# EAGLE board LiPoLoader_td (EAGLE 5.09), part 1 of 2
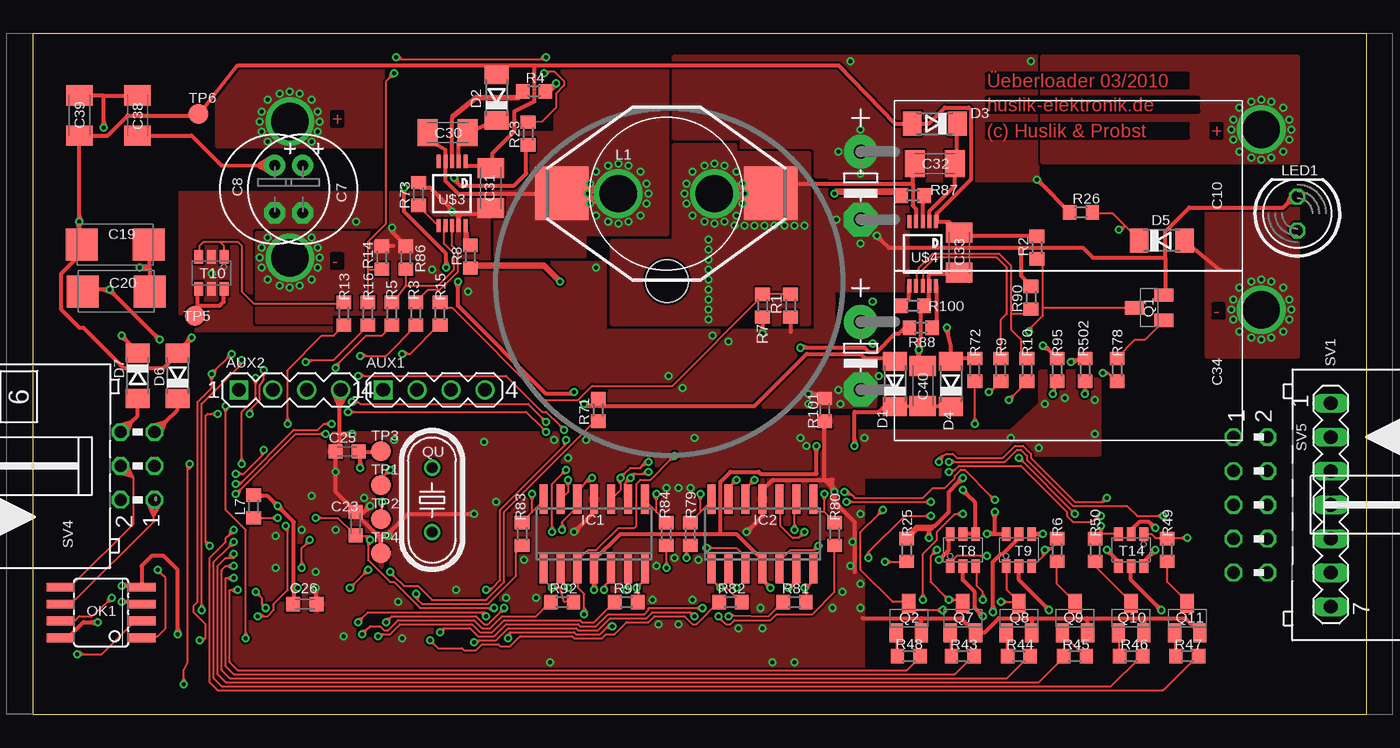
[diagram p2: board, top side]
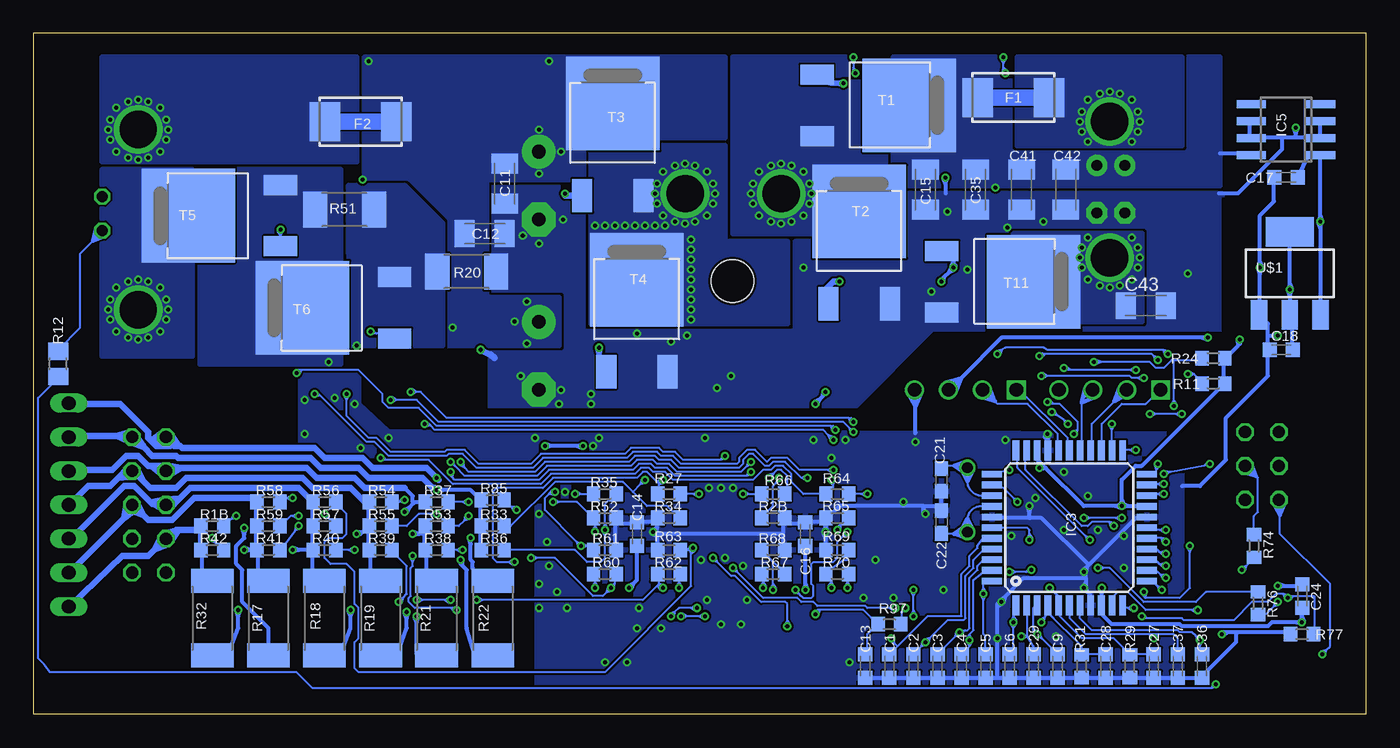
[diagram p3: board, bottom side, seen from below]

Size 99.8 x 51 mm. Coordinates in mm from the lower left corner, seen from the top.
Copper layers (1*16): Top 0.035mm / dielectric 1.5mm / Bottom 0.035mm
Design rules "Fischer-LP *": minimum track width 0.15mm, minimum drill 0.3mm, track to track 0.15mm, track to pad 0.15mm, pad to pad 0.15mm, via to via 0.15mm, smd to smd 0mil, copper to edge 0.2mm, drill to drill 0.3mm, minimum pad ring 0.2mm, minimum via ring 0.15mm, stop-mask expansion 0.1mm, vias tented up to drill 0.5mm, thermal gap 0.15mm
Net classes: 1 Hi-Power: width 0.3 mm; 2 Lo-Power: width 0.3 mm; 3 Iso-bus: clearance 0.6 mm to class 0, clearance 0.6 mm to class 1, clearance 0.6 mm to class 2
Holes 3.2 mm at 47.46,32.46
tRestrict: 16 lines
bRestrict: 9 lines
vRestrict: area 22.6,28.6 to 30.4,29.9

## Footprints (pad centres in the part's own frame; a part is rotated, then mirrored left to right if it is on the bottom)
MA04-1 = drill 1.016 square: 1 -3.81,0 | drill 1.016 round: 2 -1.27,0; 3 1.27,0; 4 3.81,0
SOLPAD3MM = drill 2.8 round: P$1 0,0
C0603K = smd 1.05 x 1.08: 1 -0.875,0; 2 0.875,0
E3,5-8 = drill 0.813 pad 1.6 round: + -1.778,0 | drill 0.813 pad 1.6 octagon: - 1.778,0
E5-13-L = drill 1.016 pad 2.54 round: + -2.54,0 | drill 1.016 pad 2.54 octagon: - 2.54,0
C1206K = smd 1.5 x 2: 1 -1.5,0; 2 1.5,0
SMC_C = smd 2.4 x 2.4: + -2.5,0; - 2.5,0
C0603 = smd 1.1 x 1: 1 -0.85,0; 2 0.85,0
SOD80C = smd 1.4 x 1.8: A 1.7,0; C -1.7,0
WSC2515 = smd 2.29 x 2.92: 1 -2.675,0; 2 2.675,0
SO14 = smd 0.6 x 2.2: 1 -3.81,-2.6; 2 -2.54,-2.6; 3 -1.27,-2.6; 4 0,-2.6; 5 1.27,-2.6; 6 2.54,-2.6; 7 3.81,-2.6; 8 3.81,2.6; 9 2.54,2.6; 10 1.27,2.6; 11 0,2.6; 12 -1.27,2.6; 13 -2.54,2.6; 14 -3.81,2.6
TQFP44 = smd 1.5 x 0.5: 1 -5.8,4; 2 -5.8,3.2; 3 -5.8,2.4; 4 -5.8,1.6; 5 -5.8,0.8; 6 -5.8,0; 7 -5.8,-0.8; 8 -5.8,-1.6; 9 -5.8,-2.4; 10 -5.8,-3.2; 11 -5.8,-4; 23 5.8,-4; 24 5.8,-3.2; 25 5.8,-2.4; 26 5.8,-1.6; 27 5.8,-0.8; 28 5.8,0; 29 5.8,0.8; 30 5.8,1.6; 31 5.8,2.4; 32 5.8,3.2; 33 5.8,4 | smd 0.5 x 1.5: 12 -4,-5.8; 13 -3.2,-5.8; 14 -2.4,-5.8; 15 -1.6,-5.8; 16 -0.8,-5.8; 17 0,-5.8; 18 0.8,-5.8; 19 1.6,-5.8; 20 2.4,-5.8; 21 3.2,-5.8; 22 4,-5.8; 34 4,5.8; 35 3.2,5.8; 36 2.4,5.8; 37 1.6,5.8; 38 0.8,5.8; 39 0,5.8; 40 -0.8,5.8; 41 -1.6,5.8; 42 -2.4,5.8; 43 -3.2,5.8; 44 -4,5.8
SO08 = smd 0.6 x 2.2: 1 -1.905,-2.6; 2 -0.635,-2.6; 3 0.635,-2.6; 4 1.905,-2.6; 5 1.905,2.6; 6 0.635,2.6; 7 -0.635,2.6; 8 -1.905,2.6
D333 = smd 4 x 4: 1 -7.82,0; 2 7.82,0
R0603 = smd 1 x 1.1: 1 -0.85,0; 2 0.85,0
LED5MM = drill 0.813 octagon: A -1.27,0; K 1.27,0
SOIC08 = smd 0.66 x 2.032: 1 -1.905,-3.073; 2 -0.635,-3.073; 3 0.635,-3.073; 4 1.905,-3.073; 5 1.905,3.073; 6 0.635,3.073; 7 -0.635,3.073; 8 -1.905,3.073
SOT23-BEC = smd 1 x 1.4: B -0.95,-1.1; C 0,1.1; E 0.95,-1.1
HC49U-V = drill 0.813 round: 1 -2.413,0; 2 2.413,0
R0805 = smd 1.3 x 1.5: 1 -0.95,0; 2 0.95,0
R2512 = smd 1.8 x 3.2: 1 -2.8,0; 2 2.8,0
R2010 = smd 1.8 x 2.7: 1 -2.2,0; 2 2.2,0
MA07-1 = drill 1.016 long: 1 -7.62,0; 2 -5.08,0; 3 -2.54,0; 4 0,0; 5 2.54,0; 6 5.08,0; 7 7.62,0
ML6L = drill 0.914 octagon: 1 -2.54,-1.27; 2 -2.54,1.27; 3 0,-1.27; 4 0,1.27; 5 2.54,-1.27; 6 2.54,1.27
ML10L = drill 0.914 octagon: 1 -5.08,-1.27; 2 -5.08,1.27; 3 -2.54,-1.27; 4 -2.54,1.27; 5 0,-1.27; 6 0,1.27; 7 2.54,-1.27; 8 2.54,1.27; 9 5.08,-1.27; 10 5.08,1.27
DPAK = smd 1.5 x 2.5: 1 -2.3,-6.9; 3 2.3,-6.9 | smd 7 x 7: 4 0,0
SUPERSOT-6 = smd 0.65 x 1: P$1 -0.95,-1.2; P$2 0,-1.2; P$3 0.95,-1.2; P$4 0.95,1.2; P$5 0,1.2; P$6 -0.95,1.2
TP15R = smd 1.5 x 1.5: TP 0,0
SOT223 = smd 1.219 x 2.235: LEFT -2.311,-3.099; MID 0,-3.099; RIGHT 2.311,-3.099 | smd 3.6 x 2.2: TAP 0,3.099
MSOP10W = smd 0.3 x 1: 1 -1,-2.4; 2 -0.5,-2.4; 3 0,-2.4; 4 0.5,-2.4; 5 1,-2.4; 6 1,2.4; 7 0.5,2.4; 8 0,2.4; 9 -0.5,2.4; 10 -1,2.4

## Placement (x,y rotation side)
AUX1  aux  [MA04-1]  30,24.3 0 top
AUX2  encoder  [MA04-1]  19.2,24.3 0 top
BATT+  SOLPAD3MM  [SOLPAD3MM]  91.95,43.8 0 top
BATT-  SOLPAD3MM  [SOLPAD3MM]  91.95,30.3 0 top
C1  100n  [C0603K]  35.7,3.6 90 bottom
C2  100n  [C0603K]  33.9,3.6 90 bottom
C3  100n  [C0603K]  32.1,3.6 90 bottom
C4  100n  [C0603K]  30.3,3.6 90 bottom
C5  100n  [C0603K]  28.5,3.6 90 bottom
C6  100n  [C0603K]  26.7,3.6 90 bottom
C7  330µF / 25V  [E3,5-8]  20.16,39.34 270 top
C8  330µF / 25V  [E3,5-8]  18.07,39.34 270 top
C9  100n  [C0603K]  23.1,3.6 90 bottom
C10  1000µF/35V  [E5-13-L]  61.95,39.6 270 top
C11  1u  [C1206K]  64.5,39.75 90 bottom
C12  10µF  [C1206K]  66,36 0 bottom
C13  100n  [C0603K]  37.5,3.6 90 bottom
C14  100n  [C0603K]  54.6,13.5 270 bottom
C15  1u  [C1206K]  33,39.3 90 bottom
C16  100n  [C0603K]  42,13.5 270 bottom
C17  100n  [C0603K]  6,40.2 0 bottom
C18  100n  [C0603K]  6.35,27.3 0 bottom
C19  100u Tan  [SMC_C]  6.13,35.18 0 top
C20  100u Tan  [SMC_C]  6.2,31.67 0 top
C21  10p  [C0603]  31.8,17.55 90 bottom
C22  10p  [C0603]  31.8,14.4 270 bottom
C23  100n  [C0603K]  24.13,14.29 270 top
C24  100n  [C0603K]  4.78,8.86 270 bottom
C25  100n  [C0603K]  23.5,19.68 0 top
C26  100n  [C0603K]  20.32,8.26 180 top
C27  100n  [C0603K]  15.9,3.6 90 bottom
C28  100n  [C0603K]  19.5,3.6 90 bottom
C29  100n  [C0603K]  24.9,3.6 90 bottom
C30  1u  [C1206K]  31.01,43.56 0 top
C31  1u  [C1206K]  34.26,39.41 90 top
C32  1u  [C1206K]  67.5,41.25 0 top
C33  1u  [C1206K]  69.33,34.58 90 top
C34  1000µF/35V  [E5-13-L]  61.95,26.85 270 top
C35  10µF  [C1206K]  29.25,39.3 270 bottom
C36  100n  [C0603K]  12.3,3.6 90 bottom
C37  100n  [C0603K]  14.1,3.6 90 bottom
C38  1u  [C1206K]  7.8,44.85 270 top
C39  1u  [C1206K]  3.45,44.85 270 top
C40  1u  [C1206K]  66.6,24.6 270 top
C41  10µF  [C1206K]  25.8,39.3 270 bottom
C42  10µF  [C1206K]  22.5,39.3 270 bottom
C43  10µF  [C1206K]  16.5,30.6 0 bottom
COIL1  SOLPAD3MM  [SOLPAD3MM]  43.8,39 0 top
COIL2  SOLPAD3MM  [SOLPAD3MM]  51,39 0 top
D1  LL43-GS08  [SOD80C]  64.5,24.75 90 top
D2  LL43-GS08  [SOD80C]  34.67,46.18 90 top
D3  LL43-GS08  [SOD80C]  67.5,44.25 180 top
D4  LL43-GS08  [SOD80C]  68.7,24.75 90 top
D5  15V BZT55C15  [SOD80C]  84.5,35.48 0 top
D6  LL43-GS08  [SOD80C]  10.8,25.35 90 top
D7  LL43-GS08  [SOD80C]  7.8,25.35 270 top
F1  Fuse 10A  [WSC2515]  26.4,46.2 0 bottom
F2  Fuse 10A  [WSC2515]  75.3,44.4 180 bottom
IC1  LM224D  [SO14]  42,13.5 0 top
IC2  LM224D  [SO14]  54.6,13.5 0 top
IC3  AVR_XMEGA_A4_44A  [TQFP44]  22.23,13.97 90 bottom
IC5  78L12SMD  [SO08]  6,43.8 90 bottom
L1  COILCRAFT_D333  [D333]  47.4,39 0 top
L7  27nH  [R0603]  16.49,15.56 90 top
LED1  [LED5MM]  94.65,37.5 90 top
OK1  ILD217  [SOIC08]  5.08,7.62 90 top
Q1  BC817-25SMD  [SOT23-BEC]  83.55,30.45 90 top
Q2  BC817-25SMD  [SOT23-BEC]  65.55,7.2 0 top
Q7  BC817-25SMD  [SOT23-BEC]  69.6,7.2 0 top
Q8  BC817-25SMD  [SOT23-BEC]  73.8,7.2 0 top
Q9  BC817-25SMD  [SOT23-BEC]  78,7.2 0 top
Q10  BC817-25SMD  [SOT23-BEC]  82.2,7.2 0 top
Q11  BC817-25SMD  [SOT23-BEC]  86.4,7.2 0 top
QU  16MHz  [HC49U-V]  29.85,16.05 90 top
R1  2k2  [R0603]  56.7,30.6 90 top
R1B  43k - 0.1%  [R0603]  86.4,14.1 0 bottom
R2  10k  [R0603]  75.15,34.95 90 top
R2B  20k - 0.1%  [R0603]  44.4,14.7 180 bottom
R3  0R  [R0603]  28.65,30 90 top
R4  10  [R0603]  37.49,46.66 180 top
R5  0R  [R0603]  26.85,30 90 top
R6  10k  [R0603]  76.65,12.3 90 top
R7  NB12K00103JBB  [R0603]  54.6,30.6 90 top
R8  10  [R0603]  32.72,34.27 90 top
R9  0R  [R0603]  72.45,25.8 270 top
R10  0R  [R0603]  74.4,25.8 270 top
R11  2k2  [R0603]  11.43,24.77 0 bottom
R12  330  [R0805]  97.95,26.25 90 bottom
R13  0R  [R0603]  23.25,30 90 top
R14  2k2  [R0603]  26.1,34.2 270 top
R15  0R  [R0603]  30.45,30 270 top
R16  0R  [R0603]  25.05,30 270 top
R17  10  [R2512]  82.2,7.2 270 bottom
R18  10  [R2512]  78,7.2 270 bottom
R19  10  [R2512]  73.8,7.2 270 bottom
R20  0.005R  [R2010]  67.35,33.15 180 bottom
R21  10  [R2512]  69.6,7.2 270 bottom
R22  10  [R2512]  65.4,7.2 270 bottom
R23  NB12K00103JBB  [R0603]  37.05,43.5 90 top
R24  2k2  [R0603]  11.43,26.67 0 bottom
R25  43k - 0.1%  [R0603]  65.4,12.3 270 top
R26  100k  [R0603]  78.45,37.6 0 top
R27  20k - 0.1%  [R0603]  52.2,16.5 180 bottom
R29  10k - 0.1%  [R0603]  17.7,3.6 270 bottom
R31  10k - 0.1%  [R0603]  21.3,3.6 270 bottom
R32  10  [R2512]  86.4,7.2 270 bottom
R33  43k - 0.1%  [R0603]  65.4,14.1 0 bottom
R34  20k - 0.1%  [R0603]  52.2,14.7 0 bottom
R35  20k - 0.1%  [R0603]  57,16.5 0 bottom
R36  43k - 0.1%  [R0603]  65.4,12.3 0 bottom
R37  43k - 0.1%  [R0603]  69.6,15.9 0 bottom
R38  10k  [R0603]  69.6,12.3 180 bottom
R39  10k  [R0603]  73.8,12.3 180 bottom
R40  10k  [R0603]  78,12.3 180 bottom
R41  10k  [R0603]  82.2,12.3 180 bottom
R42  10k  [R0603]  86.4,12.3 180 bottom
R43  4k7  [R0603]  69.6,4.35 180 top
R44  4k7  [R0603]  73.8,4.35 180 top
R45  4k7  [R0603]  78,4.35 0 top
R46  4k7  [R0603]  82.2,4.35 180 top
R47  4k7  [R0603]  86.4,4.35 180 top
R48  4k7  [R0603]  65.55,4.35 180 top
R49  10k  [R0603]  84.9,12.3 90 top
R50  10k  [R0603]  79.5,12.3 90 top
R51  0.1R  [R2010]  76.5,37.8 180 bottom
R52  20k - 0.1%  [R0603]  57,14.7 180 bottom
R53  43k - 0.1%  [R0603]  69.6,14.1 0 bottom
R54  43k - 0.1%  [R0603]  73.8,15.9 0 bottom
R55  43k - 0.1%  [R0603]  73.8,14.1 0 bottom
R56  43k - 0.1%  [R0603]  78,15.9 0 bottom
R57  43k - 0.1%  [R0603]  78,14.1 0 bottom
R58  43k - 0.1%  [R0603]  82.2,15.9 0 bottom
R59  43k - 0.1%  [R0603]  82.2,14.1 0 bottom
R60  20k - 0.1%  [R0603]  57,10.5 0 bottom
R61  20k - 0.1%  [R0603]  57,12.3 180 bottom
R62  20k - 0.1%  [R0603]  52.2,10.5 180 bottom
R63  20k - 0.1%  [R0603]  52.2,12.3 0 bottom
R64  20k - 0.1%  [R0603]  39.6,16.5 180 bottom
R65  20k - 0.1%  [R0603]  39.6,14.7 0 bottom
R66  20k - 0.1%  [R0603]  44.4,16.5 0 bottom
R67  10k - 0.1%  [R0603]  44.4,10.5 0 bottom
R68  2k - 0.1%  [R0603]  44.4,12.3 0 bottom
R69  2k - 0.1%  [R0603]  39.6,12.3 180 bottom
R70  36k - 0.1%  [R0603]  39.6,10.5 180 bottom
R71  120k - 0.1%  [R0603]  42.3,22.8 270 top
R72  120k - 0.1%  [R0603]  70.5,25.8 270 top
R73  10k  [R0603]  28.84,38.97 90 top
R74  820  [R0603]  8.4,12.6 270 bottom
R76  820  [R0603]  8.1,8.31 90 bottom
R77  10k  [R0603]  4.8,6 180 bottom
R78  4k7  [R0603]  81.15,25.8 90 top
R79  10k  [R0603]  49.2,13.5 90 top
R80  10k  [R0603]  60,13.5 90 top
R81  10k  [R0603]  57,8.4 0 top
R82  10k  [R0603]  52.2,8.4 0 top
R83  10k  [R0603]  36.6,13.5 90 top
R84  10k  [R0603]  47.4,13.5 90 top
R85  10k  [R0603]  65.4,16.05 180 bottom
R86  10k  [R0603]  27.9,34.2 90 top
R87  10  [R0603]  65.85,38.85 0 top
R88  10  [R0603]  66.45,28.95 0 top
R90  10k  [R0603]  74.7,31.2 90 top
R91  10k  [R0603]  44.4,8.4 0 top
R92  10k  [R0603]  39.6,8.4 0 top
R95  2k - 0.1%  [R0603]  76.65,25.8 90 top
R97  120k - 0.1%  [R0603]  35.7,6.75 180 bottom
R100  10k  [R0603]  65.85,30.6 0 top
R101  0R  [R0603]  59.25,22.8 90 top
R502  0R  [R0603]  78.75,25.8 270 top
SUPP+  SOLPAD3MM  [SOLPAD3MM]  19.2,44.4 0 top
SUPP-  SOLPAD3MM  [SOLPAD3MM]  19.2,34.2 0 top
SV1  spare  [MA07-1]  97.16,15.68 270 top
SV4  comm  [ML6L]  7.8,18.6 90 top
SV5  [ML10L]  91.14,15.68 270 top
T1  MOSFET-NIRLR8743  [DPAK]  34.21,45.62 270 bottom
T2  MOSFET-NIRLR8743  [DPAK]  37.95,37.65 0 bottom
T3  MOSFET-NIRLR8743  [DPAK]  56.4,45.75 0 bottom
T4  MOSFET-NIRLR8743  [DPAK]  54.6,32.55 0 bottom
T5  MOSFET-NIRLR8743  [DPAK]  88.2,37.35 90 bottom
T6  MOSFET-NIRLR8743  [DPAK]  79.65,30.45 90 bottom
T8  QS6J1=FDC6312P  [SUPERSOT-6]  69.6,12.3 0 top
T9  QS6J1=FDC6312P  [SUPERSOT-6]  73.8,12.3 0 top
T10  FDC6401N  [SUPERSOT-6]  13.33,33.05 180 top
T11  MOSFET-NIRLR8743  [DPAK]  24.88,32.41 270 bottom
T14  QS6J1=FDC6312P  [SUPERSOT-6]  82.2,12.3 180 top
TP1  TPTP15R  [TP15R]  26.04,17.14 0 top
TP2  TPTP15R  [TP15R]  26.04,14.61 0 top
TP3  TPTP15R  [TP15R]  26.04,19.68 0 top
TP4  TPTP15R  [TP15R]  26.04,12.06 0 top
TP5  TPTP15R  [TP15R]  12.1,29.84 0 top
TP6  TPTP15R  [TP15R]  12.35,44.98 0 top
U$1  LM1117  [SOT223]  5.71,33.02 0 bottom
U$2  [GEH_FISCHER_AKG55XX100]  0,0 0 top
U$3  LM5106  [MSOP10W]  31.35,39 180 top
U$4  LM5106  [MSOP10W]  66.6,34.5 180 top

## Tracks (layer width: path | path; a pad name or v marks a point on that pad's centre or on a via)
0V  (via drill 0.3)
  Top 0.3: 31.88,37.27 32.1,37.5 33.9,37.5 C31.1 | 31.88,37.27 31.8,37.2 31.8,36.6 U$3.9 | 31.12,38.03 29.7,39.45 28.95,39.45 R73.2 | 31.12,38.03 31.43,37.73 | 31.43,37.73 31.73,37.42 | 31.73,37.42 31.88,37.27 | 31.43,37.73 v31.35,37.65 | C33.1 69.3,33 67.2,33 67.05,32.85 67.05,32.1 | 84.75,34.2 84.75,31.5 Q1.E | 84.75,34.2 84.75,36.15 86.55,37.95 93.6,37.95 93.97,38.32 | C33.1 69.3,32.85 | 5.25,46.35 C38.1 | 5.25,46.35 C39.1 | v5.25,43.95 5.25,44.4 | 5.25,44.4 5.25,46.35 | C33.1 69.45,33.15 | 59.25,23.7 R101.2 59.25,24 58.5,24 | v58.05,24 58.5,24 | v66.3,27.3 66.3,26.85 | 66.3,26.85 66.3,26.4 C40.1 | v66.3,27.3 66.3,27.75 | 66.3,27.75 66.3,28.05 66.45,28.2 66.45,30.45 66.6,30.6 R100.2 66.75,30.6 67.05,30.9 67.05,32.1 | 67.05,32.1 U$4.9 | 31.73,39.82 31.5,40.05 v31.5,40.2 | 31.73,39.82 31.95,39.6 36,39.6 36.9,40.5 36.9,42.45 37.05,42.6 R23.1 | 63.47,35.53 v63.15,35.85 | 63.47,35.53 64.05,34.95 73.95,34.95 | 73.95,34.95 78.6,34.95 79.35,34.2 84.75,34.2 | 54.6,29.85 R7.1 54.6,28.95 | C10.- 61.95,37.2 | 54.6,28.95 v54.6,28.5 | 26.98,36.02 27.9,35.1 R86.2 | 26.98,36.02 26.85,36.15 v26.85,36.45 | 73.95,34.95 73.95,32.85 74.7,32.1 R90.2 | 93.97,38.32 94.65,38.7 LED1.K | R14.1 26.1,35.1 26.96,35.1 | R1.1 56.7,28.65 | 31.12,38.03 31.2,37.62 v31.35,37.65 | 31.12,38.03 31.45,37.77 v31.35,37.65 | 31.73,37.42 31.47,37.74 v31.35,37.65 | 31.73,37.42 31.32,37.5 v31.35,37.65 | 58.5,24 58.1,24.14 v58.05,24 | 58.5,24 58.1,23.86 v58.05,24 | 5.25,44.4 5.11,44 v5.25,43.95 | 5.25,44.4 5.39,44 v5.25,43.95 | 31.73,39.82 31.65,40.23 v31.5,40.2 | 31.73,39.82 31.41,40.08 v31.5,40.2 | 63.47,35.53 63.28,35.91 v63.15,35.85 | 63.47,35.53 63.09,35.72 v63.15,35.85
  Top 0.3: 66.3,26.85 66.44,27.25 v66.3,27.3 | 66.3,26.85 66.16,27.25 v66.3,27.3 | 66.3,27.75 66.16,27.35 v66.3,27.3 | 66.3,27.75 66.44,27.35 v66.3,27.3 | 54.6,28.95 54.46,28.55 v54.6,28.5 | 54.6,28.95 54.74,28.55 v54.6,28.5 | 26.98,36.02 27,36.44 v26.85,36.45 | 26.98,36.02 26.73,36.36 v26.85,36.45 | 93.97,38.32 94.81,38.34 LED1.K | 93.97,38.32 94.21,38.89 LED1.K
  Bottom 0.3: IC5.3 3.45,44.4 3.45,43.2 IC5.2 3.6,43.2 5.25,43.2 | IC5.6 8.7,44.4 8.7,43.2 IC5.7 8.55,43.2 6.3,43.2 | 5.25,43.2 6.3,43.2 | 6.3,43.2 6.3,42.3 9.6,39 11,39 | 5.25,43.2 5.25,43.5 | 5.25,43.5 v5.25,43.95 | v31.5,40.2 31.5,39.75 | 31.5,39.75 31.5,39 | 5.25,43.5 5.39,43.9 v5.25,43.95 | 5.25,43.5 5.11,43.9 v5.25,43.95 | 31.5,39.75 31.64,40.15 v31.5,40.2 | 31.5,39.75 31.36,40.15 v31.5,40.2
  Bottom 0.5: v66.3,27.3 65.4,26.85 65.25,26.7 65.55,26.95
  other vias: 13.35,33 60.3,24.3 63.3,25.35 61.95,35.25 60.15,37.05 58.05,23.25 60.45,23.25 48.6,24.45 52.05,27.9 50.85,28.35 47.55,25.35 42.15,33.45 29.85,33.3 32.55,31.65 24.15,36.9
  pour Top (no thermals): 15.06,34.96 11.6,34.96 11.6,31.15 15.06,31.15
  pour Bottom (rank 4, no thermals): 10.8,39 10.8,28.8 32.4,28.8 38.4,22.8 65.55,22.8 65.55,39.45 58.65,39.45 58.65,28.65 42.75,28.65 42.75,35.4 35.4,35.4 35.4,39
  pour Top (no thermals): 60.6,23.1 57.9,23.1 57.9,24.45 60.6,24.45
  pour Top (rank 4, no thermals): 10.95,39 34.05,39 34.05,33.75 42.75,33.75 42.75,28.65 58.65,28.65 58.65,39.45 65.4,39.45 65.4,31.8 59.85,31.8 59.85,27.15 63,27.15 63,23.1 38.25,23.1 32.55,28.8 10.95,28.8
+3V3  (via drill 0.3)
  Top 0.3: 4.35,6.9 3.75,6.9 2.7,5.85 2.1,5.85 OK1.8 | 4.35,6.9 v4.8,6.9 | 19.5,9.45 19.5,9.79 | 19.5,9.79 19.5,14.4 18.62,15.28 | 19.5,9.45 19.5,9.11 | 19.5,9.11 19.5,8.4 C26.2 | v18.3,15.6 17.98,15.92 | 17.98,15.92 17.55,16.35 16.5,16.35 L7.2 | 18.62,15.28 v18.3,15.6 | v19.8,9.45 19.5,9.45 | TP3.TP 25.95,19.65 24.45,19.65 C25.2 24.45,19.5 24.45,18.9 | v24.45,18.45 24.45,18.9 | v5.7,31.8 5.25,31.8 | 5.25,31.8 3.75,31.8 C20.+ | v9.45,28.05 9.13,28.37 | 9.13,28.37 6.02,31.48 | 6.02,31.48 v5.7,31.8 | 4.35,6.9 4.75,6.76 v4.8,6.9 | 4.35,6.9 4.75,7.04 v4.8,6.9 | 19.5,9.79 19.66,9.39 v19.8,9.45 | 19.5,9.79 19.87,9.58 v19.8,9.45 | 19.5,9.11 19.87,9.32 v19.8,9.45 | 19.5,9.11 19.66,9.51 v19.8,9.45 | 24.45,18.9 24.31,18.5 v24.45,18.45 | 24.45,18.9 24.59,18.5 v24.45,18.45 | 17.98,15.92 18.16,15.54 v18.3,15.6 | 17.98,15.92 18.36,15.73 v18.3,15.6 | 18.62,15.28 18.43,15.66 v18.3,15.6 | 18.62,15.28 18.23,15.46 v18.3,15.6 | 5.25,31.8 5.65,31.66 v5.7,31.8 | 5.25,31.8 5.65,31.94 v5.7,31.8 | 6.02,31.48 5.83,31.86 v5.7,31.8 | 6.02,31.48 5.63,31.66 v5.7,31.8 | 9.13,28.37 9.31,27.98 v9.45,28.05 | 9.13,28.37 9.52,28.18 v9.45,28.05
  Bottom 0.3: v4.8,6.9 4.8,7.35 | 4.8,7.35 4.8,7.95 C24.2 | 19.8,9 19.8,8.25 IC3.9 19.8,8.1 19.8,7.5 19.05,6.75 13.95,6.75 13.8,6.6 7.35,6.6 7.05,6.9 5.25,6.9 | 19.8,9 v19.8,9.45 | C18.2 5.55,27.45 5.55,29.7 5.7,29.85 U$1.MID 5.7,30.15 5.7,31.35 | v5.7,31.8 5.7,31.35 | v5.7,31.8 5.7,32.25 | 5.7,32.25 5.7,36 U$1.TAP | v18.3,15.6 18.75,15.6 | 18.75,15.6 21.15,15.6 24,18.45 | v18.3,15.6 17.85,15.6 | 17.85,15.6 16.5,15.6 IC3.19 | 24.23,18.68 24.45,18.9 | 24.45,18.9 24.6,19.05 24.6,19.65 IC3.31 | 24,18.45 24.23,18.68 | v18.3,15.6 18.3,16.05 | 18.3,16.05 18.3,17.55 17.25,18.6 16.8,18.6 10.65,24.75 R11.2 10.65,24.9 10.65,26.55 R24.2 10.5,26.7 9.58,27.62 | 24.23,18.68 v24.45,18.45 | v4.8,6.9 5.25,6.9 | v9.45,28.05 9.45,27.75 9.58,27.62 | 4.8,7.35 4.66,6.95 v4.8,6.9 | 4.8,7.35 4.94,6.95 v4.8,6.9 | 5.25,6.9 4.85,7.04 v4.8,6.9 | 5.25,6.9 4.7,6.83 v4.8,6.9 | 19.8,9 19.94,9.4 v19.8,9.45 | 19.8,9 19.66,9.4 v19.8,9.45 | 24.45,18.9 24.31,18.5 v24.45,18.45 | 24.45,18.9 24.59,18.5 v24.45,18.45 | 24,18.45 24.4,18.31 v24.45,18.45 | 24,18.45 24.4,18.59 v24.45,18.45 | 18.75,15.6 18.35,15.74 v18.3,15.6 | 18.75,15.6 18.35,15.46 v18.3,15.6 | 17.85,15.6 18.25,15.46 v18.3,15.6 | 17.85,15.6 18.25,15.74 v18.3,15.6 | 18.3,16.05 18.16,15.65 v18.3,15.6 | 18.3,16.05 18.44,15.65 v18.3,15.6 | 5.7,31.35 5.84,31.75 v5.7,31.8 | 5.7,31.35 5.56,31.75 v5.7,31.8 | 5.7,32.25 5.56,31.85 v5.7,31.8 | 5.7,32.25 5.84,31.85 v5.7,31.8 | 9.58,27.62 9.6,28.04 v9.45,28.05 | 9.58,27.62 9.33,27.96 v9.45,28.05
+12V  (via drill 0.3)
  Top 0.3: C31.2 33.9,40.5 | 67.65,36.9 68.55,36.9 69.3,36.15 C33.2 | C33.2 69.45,36 | D3.A 67.05,44.25 68.25,45.45 70.05,45.45 70.2,45.3 70.2,40.05 67.65,37.5 67.65,36.9 | 34.8,48.6 15.3,48.6 12.45,45 TP6.TP 12.3,44.85 7.05,44.85 5.55,43.35 C39.2 3.45,37.35 | 34.8,48.6 34.8,48 D2.A | 34.35,40.8 34.35,40.65 C31.2 | C31.2 33.42,41.05 32.35,41.05 U$3.1 | 3.45,36.45 3.45,35.4 3.6,35.25 C19.+ 3.6,35.1 3.6,34.5 2.1,33 2.1,30.3 3.45,28.95 3.75,28.95 6.75,25.95 9.75,25.95 10.8,27 D6.A 10.8,27.15 11.53,27.88 | 3.45,36.45 v3.45,36.9 | v3.45,36.9 3.45,37.35 | 11.53,27.88 v11.85,28.2 | 67.65,36.9 U$4.1 | D3.A 64.5,44.25 60.3,48.6 37.5,48.6 | 34.8,48.6 37.5,48.6 | D3.A 65.7,44.25 | R2.2 75.15,35.85 69.33,35.85 C33.2 | 37.5,48.6 37.5,45.9 36,45.15 36,43.65 34.35,42 | 11.53,27.88 11.91,28.07 v11.85,28.2 | 11.53,27.88 11.71,28.27 v11.85,28.2 | 3.45,36.45 3.59,36.85 v3.45,36.9 | 3.45,36.45 3.31,36.85 v3.45,36.9 | 3.45,37.35 3.31,36.95 v3.45,36.9 | 3.45,37.35 3.59,36.95 v3.45,36.9
  Top 0.305: 34.35,42 34.35,40.8
  Bottom 0.3: C17.2 5.1,40.2 4.35,41.85 IC5.1 3.45,41.7 3.45,37.35 | v3.45,36.9 3.45,37.35 | v3.45,36.9 3.45,36.45 | 3.45,36.45 3.45,30 U$1.RIGHT | 30.34,25.16 27.3,28.2 12.3,28.2 | 30.34,25.16 31.2,24.3 AUX1.3 | v11.85,28.2 12.3,28.2 | 12.3,28.2 11.9,28.34 v11.85,28.2 | 12.3,28.2 11.9,28.06 v11.85,28.2 | 3.45,37.35 3.31,36.95 v3.45,36.9 | 3.45,37.35 3.59,36.95 v3.45,36.9 | 3.45,36.45 3.59,36.85 v3.45,36.9 | 3.45,36.45 3.31,36.85 v3.45,36.9 | 30.34,25.16 30.75,24.1 AUX1.3 | 30.34,25.16 31.43,24.83 AUX1.3
+UB  (via drill 0.3)
  Top 0.3: 70.2,26.7 70.5,26.7 R72.1 70.05,26.7 68.7,26.7 | 68.7,26.7 68.55,26.55 D4.A 68.7,26.7 | 68.7,26.7 68.7,27.6 68.5,28.51 | 68.5,28.51 v68.4,28.95 | R26.1 77.55,37.65 75.47,39.73 | 75.47,39.73 v75.15,40.05 | 68.5,28.51 68.55,28.93 v68.4,28.95 | 68.5,28.51 68.27,28.87 v68.4,28.95 | 75.47,39.73 75.28,40.12 v75.15,40.05 | 75.47,39.73 75.08,39.91 v75.15,40.05
  Bottom 0.3: v75.15,40.05 75,40.16
  other vias: 60.3,42.15 61.95,40.5 61.95,43.8 62.85,27.75 63.75,29.4 62.85,30.9 61.2,48.9 74.7,48.9
  pour Bottom (rank 2, no thermals): 48,49.2 48,43.2 57.6,43.2 57.6,40.05 75,40.05 75,49.2
  pour Bottom (rank 2, no thermals): 65.85,40.2 65.85,31.2 60.45,31.2 60.45,27.6 68.7,27.6 68.7,36.9 71.85,40.05 68.7,40.05
  pour Top (rank 2, no thermals): 75.15,49.2 48,49.2 48,43.2 53.1,43.2 53.1,42.45 58.65,42.45 58.65,40.35 59.7,40.35 59.7,40.05 75.15,40.05
AVCC  (via drill 0.3)
  Top 0.15: 17.85,14.7 L7.1 | 17.85,14.7 v18.3,14.7 | v21.15,14.7 21.6,14.7 | 21.6,14.7 22.8,14.7 24,13.5 C23.2 24.15,13.35 24.86,13.35 | 25.05,12.63 25.05,12.9 v25.2,13.05 | 25.05,12.63 25.05,11.55 26.7,9.9 27,9.9 28.95,7.95 34.05,7.95 | 24.86,13.35 25.2,13.35 25.35,13.2 v25.2,13.05 | 34.05,7.95 v34.5,7.95 | 17.85,14.7 18.19,14.51 v18.3,14.7 | 17.85,14.7 18.19,14.89 v18.3,14.7 | 21.6,14.7 21.26,14.89 v21.15,14.7 | 21.6,14.7 21.26,14.51 v21.15,14.7 | 25.05,12.63 25.35,12.88 v25.2,13.05 | 25.05,12.63 24.98,13.01 v25.2,13.05 | 24.86,13.35 24.99,12.98 v25.2,13.05 | 24.86,13.35 25.25,13.27 v25.2,13.05 | 34.05,7.95 34.39,7.75 v34.5,7.95 | 34.05,7.95 34.39,7.84 v34.5,7.95
  Bottom 0.15: v18.3,14.7 18.75,14.7 | 18.75,14.7 20.7,14.7 | 20.7,14.7 v21.15,14.7 | v25.2,13.05 25.2,13.5 | 25.2,13.5 25.2,13.8 25.35,13.95 27.75,13.95 27.9,14.1 IC3.39 | 34.8,7.61 34.8,7.65 v34.5,7.95 | 34.8,7.61 34.8,6.75 R97.1 | 18.75,14.7 18.41,14.89 v18.3,14.7 | 18.75,14.7 18.41,14.51 v18.3,14.7 | 20.7,14.7 21.04,14.51 v21.15,14.7 | 20.7,14.7 21.04,14.89 v21.15,14.7 | 25.2,13.5 25,13.16 v25.2,13.05 | 25.2,13.5 25.39,13.16 v25.2,13.05 | 34.8,7.61 34.57,8 v34.5,7.95 | 34.8,7.61 34.43,7.74 v34.5,7.95
BALANCE1  (via drill 0.3)
  Top 0.15: R48.1 66.3,4.2 65.4,3.3 15.3,3.3 14.7,3.9 14.7,9.3 14.85,9.3 | 14.85,9.3 v15.3,9.3 | 14.85,9.3 15.19,9.11 v15.3,9.3 | 14.85,9.3 15.19,9.49 v15.3,9.3
  Bottom 0.15: v15.3,9.3 15.62,9.62 | 15.62,9.62 15.9,9.9 IC3.12 | 15.62,9.62 15.24,9.52 v15.3,9.3 | 15.62,9.62 15.52,9.24 v15.3,9.3
BALANCE2  (via drill 0.3)
  Top 0.15: R43.1 70.2,4.2 69,3 15,3 14.4,3.6 14.4,10.2 14.55,10.2 | 14.55,10.2 v15,10.2 | 14.55,10.2 14.89,10.01 v15,10.2 | 14.55,10.2 14.89,10.39 v15,10.2
  Bottom 0.15: v15,10.2 15.15,10.2 15.38,10.43 | 15.38,10.43 15.6,10.65 16.2,10.65 16.2,10.8 IC3.13 | 15.38,10.43 14.99,10.43 v15,10.2 | 15.38,10.43 15.2,10.09 v15,10.2
BALANCE3  (via drill 0.3)
  Top 0.15: R44.1 74.4,4.2 72.9,2.7 14.7,2.7 14.1,3.3 14.1,10.8 14.4,11.1 14.55,11.1 | 14.55,11.1 v15,11.1 | 14.55,11.1 14.89,10.9 v15,11.1 | 14.55,11.1 14.89,11.29 v15,11.1
  Bottom 0.15: v15,11.1 15.3,11.1 15.43,11.23 | 15.43,11.23 15.6,11.4 16.2,11.4 IC3.14 | 15.43,11.23 15.05,11.32 v15,11.1 | 15.43,11.23 15.16,10.95 v15,11.1
BALANCE4  (via drill 0.3)
  Top 0.15: R45.1 77.1,4.2 75.3,2.4 14.4,2.4 13.8,3 13.8,11.1 14.4,11.7 14.66,11.7 | 14.66,11.7 15,11.7 v15,12 | 14.66,11.7 15.05,11.78 v15,12 | 14.66,11.7 14.79,12.07 v15,12
  Bottom 0.15: v15,12 15.3,12 15.43,12.13 | 15.43,12.13 15.6,12.3 16.2,12.3 IC3.15 | 15.43,12.13 15.05,12.22 v15,12 | 15.43,12.13 15.16,11.85 v15,12
BALANCE5  (via drill 0.3)
  Top 0.15: R46.1 82.8,4.2 80.7,2.1 14.1,2.1 13.5,2.7 13.5,11.4 14.68,12.58 | 14.68,12.58 v15,12.9 | 14.68,12.58 15.06,12.68 v15,12.9 | 14.68,12.58 14.78,12.96 v15,12.9
  Bottom 0.15: 15.34,13.2 15.3,13.2 v15,12.9 | 15.34,13.2 16.2,13.2 IC3.16 | 15.34,13.2 14.95,13.12 v15,12.9 | 15.34,13.2 15.21,12.83 v15,12.9
BALANCE6  (via drill 0.3)
  Top 0.15: R47.1 87,4.2 84.6,1.8 13.8,1.8 13.2,2.4 13.2,11.7 14.4,12.9 14.4,13.2 14.68,13.48 | 14.68,13.48 v15,13.8 | 14.68,13.48 15.06,13.58 v15,13.8 | 14.68,13.48 14.78,13.86 v15,13.8
  Bottom 0.15: IC3.17 16.2,13.8 15.45,13.8 | v15,13.8 15.45,13.8 | 15.45,13.8 15.11,13.99 v15,13.8 | 15.45,13.8 15.11,13.61 v15,13.8
BATT-  (via drill 0.3)
  Top 0.3: D5.A 86.25,35.4 88.8,33.3 88.95,33.3
  other vias: 93.6,31.95 91.95,32.55 91.95,28.05 94.2,30.3 89.7,30.3 89.85,31.05 90.3,31.95 91.2,32.4 92.7,32.4 91.2,28.2 92.7,28.2 94.05,29.55 94.05,31.05 93.6,28.65 89.85,29.55 90.3,28.65
  pour Bottom (no thermals): 87.9,40.8 87.9,26.85 94.65,26.85 94.65,40.8
  pour Top (no thermals): 87.9,40.8 87.9,26.85 94.65,26.85 94.65,40.8
BATT-A  (via drill 0.3)
  Top 0.3: R502.1 78.75,26.55 78.12,26.55 | 77.85,26.55 78.12,26.55 | v77.7,26.4 77.85,26.55 | 77.85,26.55 77.7,26.55 v77.7,26.4 | 78.12,26.55 77.79,26.28 v77.7,26.4
  pour Bottom (no thermals): 76.8,40.8 76.8,36 76.8,26.25 87.3,26.25 87.3,40.8
BATT-B  (via drill 0.3)
  Top 0.3: 75.98,27.37 75.75,27.6 v75.6,27.6 | 75.98,27.37 76.65,26.7 R95.2 | 75.98,27.37 75.72,27.7 v75.6,27.6 | 75.98,27.37 75.57,27.45 v75.6,27.6
  Bottom 0.3: v75.6,27.6 75.8,27.6
  pour Bottom (no thermals): 69.15,36.75 72,39.6 76.2,39.6 76.2,35.4 76.05,27.6 69.15,27.6
BUS_GND  (via drill 0.3)
  Top 0.15: v3.3,4.5 3.75,4.5 | 3.75,4.5 5.1,4.5 7.5,6.9 8.1,6.9 OK1.2 | 3.75,4.5 3.41,4.7 v3.3,4.5 | 3.75,4.5 3.41,4.3 v3.3,4.5
  Bottom 0.15: v3.3,4.5 2.98,4.82 | 2.98,4.82 2.7,5.1 2.7,9.75 6.45,13.5 6.45,14.92 6.45,16.05 SV4.2 | 2.98,4.82 3.08,4.44 v3.3,4.5 | 2.98,4.82 3.36,4.72 v3.3,4.5
  Bottom 0.3: 6.45,14.92 6.97,15.8 SV4.2 6.06,15.87 6.45,14.92
BUS_RX
  Bottom 0.15: R74.1 8.4,14.85 8.1,15.15 8.1,17.7 8.23,17.83 9,18.6 SV4.3
  Bottom 0.3: 8.23,17.83 9.21,18.11 SV4.3 8.6,18.78 8.23,17.83
BUS_SUPP
  Top 0.15: OK1.6 3,8.25 3,8.4 9,14.4 9,14.92 9,16.05 SV4.1
  Top 0.3: 9,14.92 9.51,15.81 SV4.1 8.6,15.86 9,14.92
BUS_TX
  Top 0.15: SV4.4 6.6,18.6 7.37,17.83 7.5,17.7 7.5,14.25 3,9.75 OK1.5
  Top 0.3: 7.37,17.83 7,18.78 SV4.4 6.39,18.11 7.37,17.83
CELL1  (via drill 0.3)
  Top 0.3: 70.5,13.5 70.5,15.9 69.92,16.48 | v69.6,16.8 69.92,16.48 | 70.5,13.5 T8.P$5 | 70.5,13.5 T8.P$4 | 69.92,16.48 69.73,16.86 v69.6,16.8 | 69.92,16.48 69.53,16.66 v69.6,16.8
  Bottom 0.3: 66.3,14.1 66.3,12.3 R36.1 | 66.3,14.1 66.3,15.9 R85.2 66.3,16.05 67.05,16.8 69.15,16.8 | 66.3,14.1 R33.1 | 69.15,16.8 v69.6,16.8 | 69.15,16.8 69.7,16.66 v69.6,16.8 | 69.15,16.8 69.55,16.94 v69.6,16.8
  Bottom 0.5: v69.6,16.8 69.75,16.95 69.9,16.95 70.65,17.7 74.7,17.7 75.45,18.45 78.3,18.45 79.05,19.2 88.95,19.2 89.1,19.35 90.9,19.35 91.55,20 | 91.55,20 92.25,20.7 92.4,20.7 SV5.2 | SV1.2 97.05,20.85 93.55,20.85 | 93.55,20.85 92.55,20.85 SV5.2 | 91.55,20 92.55,20.38 SV5.2 | 91.55,20 92.2,20.95 SV5.2 | 93.55,20.85 92.53,21.15 SV5.2 | 93.55,20.85 92.58,20.39 SV5.2
CELL2  (via drill 0.3)
  Top 0.3: v71.4,13.5 71.85,13.5 | 71.85,13.5 72,13.5 | 72,13.5 T9.P$6 | 72,13.5 72,14.7 | 72,14.7 v72,15.15 | 71.85,13.5 71.45,13.64 v71.4,13.5 | 71.85,13.5 71.45,13.36 v71.4,13.5 | 72,14.7 72.14,15.1 v72,15.15 | 72,14.7 71.86,15.1 v72,15.15
  Bottom 0.3: 70.5,13.5 70.5,12.3 R38.2 70.35,12.3 70.35,10.8 69.6,10.05 R21.1 | 70.5,13.5 70.5,13.95 R53.1 | 70.5,13.5 70.95,13.5 | 70.95,13.5 v71.4,13.5 | v72,15.15 71.68,15.47 | 71.68,15.47 71.33,15.82 | 71.33,15.82 71.25,15.9 R37.1 | 72,16.95 71.4,16.35 71.4,15.9 71.33,15.82 | 70.95,13.5 71.35,13.36 v71.4,13.5 | 70.95,13.5 71.35,13.64 v71.4,13.5 | 71.68,15.47 71.86,15.09 v72,15.15 | 71.68,15.47 72.06,15.29 v72,15.15
  Bottom 0.5: 72,16.95 75,16.95 75.75,17.7 78.6,17.7 79.35,18.45 88.75,18.45 | SV5.3 89.85,18.3 89.1,18.3 88.95,18.45 88.75,18.45 | 90.95,18.6 90.15,18.6 90,18.45 SV5.3 | 90.95,18.6 91.2,18.6 91.95,19.35 92.85,19.35 93.9,18.3 97.05,18.3 SV1.3 | 88.75,18.45 89.65,17.88 SV5.3 | 88.75,18.45 89.8,18.62 SV5.3 | 90.95,18.6 89.88,18.63 SV5.3 | 90.95,18.6 90.13,17.91 SV5.3
CELL3  (via drill 0.3)
  Top 0.3: v75.6,13.5 75.15,13.5 | 75.15,13.5 T9.P$4 | 75.15,13.5 75.55,13.36 v75.6,13.5 | 75.15,13.5 75.55,13.64 v75.6,13.5
  Bottom 0.3: v75.6,13.5 75.3,13.5 75.17,13.63 | 74.7,14.1 75.17,13.63 | 74.7,14.1 74.7,15.75 R54.1 | 74.7,14.1 R55.1 74.7,13.95 74.7,12.3 R39.2 74.55,12.3 74.55,10.8 73.8,10.05 R19.1 | 75.17,13.63 75.51,13.38 v75.6,13.5 | 75.17,13.63 75.59,13.65 v75.6,13.5
  Bottom 0.5: R54.1 74.85,15.75 76.05,16.95 78.9,16.95 79.65,17.7 88.35,17.7 89.1,16.95 91.05,16.95 91.56,17.46 | SV5.4 92.4,18.15 | 91.56,17.46 92.1,18 92.25,18 SV5.4 | 93.44,17.71 92.55,18.6 92.4,18.45 SV5.4 | 93.44,17.71 94.05,17.1 95.7,17.1 97.05,15.75 SV1.4 | 91.56,17.46 92.41,18.29 SV5.4 | 91.56,17.46 92.05,18.41 SV5.4 | 93.44,17.71 92.71,18.5 SV5.4 | 93.44,17.71 92.37,17.81 SV5.4
CELL4  (via drill 0.3)
  Top 0.3: v80.4,12.3 80.72,11.98 | 80.72,11.98 81.15,11.55 81.15,11.1 T14.P$4 | 80.72,11.98 80.53,12.37 v80.4,12.3 | 80.72,11.98 80.33,12.16 v80.4,12.3
  Bottom 0.3: 78.9,14.1 78.9,15.75 R56.1 | 78.9,12.3 78.9,14.1 | 78.9,14.1 R57.1 | 78.9,12.3 R40.2 | 78.9,12.3 78.9,10.5 R18.1 | 78.9,12.3 79.95,12.3 | 79.95,12.3 v80.4,12.3 | 79.95,12.3 80.35,12.16 v80.4,12.3 | 79.95,12.3 80.35,12.44 v80.4,12.3
  Bottom 0.5: R56.1 78.9,15.9 79.95,16.95 88.05,16.95 88.83,16.16 | SV5.5 89.85,15.75 | 88.83,16.16 89.25,15.75 89.85,15.45 SV5.5 | 91,15.85 90.9,15.75 90.3,15.75 SV5.5 | 91,15.85 92.25,17.1 93,17.1 96.9,13.2 SV1.5 | 88.83,16.16 89.58,15.4 SV5.5 | 88.83,16.16 89.9,16.09 SV5.5 | 91,15.85 89.96,16.08 SV5.5 | 91,15.85 90.07,15.32 SV5.5
CELL5  (via drill 0.3)
  Top 0.3: v84,12.3 83.68,11.98 | 83.68,11.98 83.25,11.55 83.25,11.1 T14.P$6 | 83.68,11.98 84.06,12.16 v84,12.3 | 83.68,11.98 83.86,12.37 v84,12.3
  Bottom 0.3: 83.1,14.1 83.1,15.6 R58.1 | 83.1,12.3 83.55,12.3 | 83.55,12.3 v84,12.3 | 83.1,12.3 83.1,14.1 | 83.1,14.1 R59.1 | 83.1,12.3 R41.2 82.95,12.3 82.95,10.8 82.2,10.05 R17.1 | 83.55,12.3 83.95,12.16 v84,12.3 | 83.55,12.3 83.95,12.44 v84,12.3
  Bottom 0.5: R58.1 83.1,15.9 83.4,16.2 87.75,16.2 89.4,14.55 91.2,14.55 91.56,14.91 | 91.56,14.91 92.25,15.6 SV5.6 | SV5.6 92.25,15.45 93,14.7 | 93,14.7 97.05,10.65 SV1.6 | 91.56,14.91 92.56,15.3 SV5.6 | 91.56,14.91 92.05,15.86 SV5.6 | 93,14.7 92.81,15.75 SV5.6 | 93,14.7 92.16,15.36 SV5.6
CELL6
  Bottom 0.3: R1B.1 87.3,13.95 87.3,12.3 R42.2 87.15,12.3 87.15,10.8 86.4,10.05 R32.1
  Bottom 0.5: 87.3,14.1 R1B.1 87.45,13.95 87.6,13.8 88.94,13.8 | SV5.7 90,13.05 | 88.94,13.8 89.1,13.8 89.7,13.2 SV5.7 | SV1.7 97.05,8.1 93.15,11.85 91.2,11.85 90.7,12.35 | 90.7,12.35 90.15,12.9 SV5.7 | 88.94,13.8 89.53,12.91 SV5.7 | 88.94,13.8 89.97,13.53 SV5.7 | 90.7,12.35 90.24,13.32 SV5.7 | 90.7,12.35 89.71,12.76 SV5.7
CELLGND  (via drill 0.3)
  Top 0.3: 67.2,13.95 67.35,14.1 67.5,14.1 68.55,15.15 68.55,16.65 69.28,17.38 | v67.05,13.2 67.05,13.65 | 67.05,13.65 67.05,13.95 | 69.28,17.38 v69.6,17.7 | 67.05,13.65 66.91,13.25 v67.05,13.2 | 67.05,13.65 67.19,13.25 v67.05,13.2 | 69.28,17.38 69.67,17.57 v69.6,17.7 | 69.28,17.38 69.47,17.77 v69.6,17.7
  Top 0.5: 67.2,13.95 67.05,13.95 66.15,13.95 65.4,13.2 R25.1
  Bottom 0.3: 67.05,12.75 67.05,11.55 66.9,11.4 66.9,10.95 66.6,10.2 R22.1 | 67.05,12.75 v67.05,13.2 | 67.05,12.75 67.19,13.15 v67.05,13.2 | 67.05,12.75 67.13,13.3 v67.05,13.2
  Bottom 0.5: 69.45,17.55 v69.6,17.7 70.35,18.45 74.4,18.45 75.15,19.2 78,19.2 78.75,19.95 88.65,19.95 88.8,20.1 88.94,20.1 | 88.94,20.1 89.25,20.1 89.4,20.25 | 89.4,20.25 89.85,20.7 SV5.1 | 90.98,20.48 90.6,20.1 89.55,20.1 89.4,20.25 | 90.98,20.48 91.2,20.7 91.2,21.15 93.3,23.25 97.05,23.25 SV1.1 | 88.94,20.1 89.97,20.37 SV5.1 | 88.94,20.1 89.53,20.99 SV5.1 | 90.98,20.48 90.11,21.09 SV5.1 | 90.98,20.48 89.92,20.36 SV5.1
CURR_SENS_SW  (via drill 0.3)
  Top 0.15: v15.6,18.75 15.6,19.2 | 15.6,19.2 15.6,22.65 16.65,23.7 16.65,24.75 | 16.65,24.75 v16.65,25.2 | v24.3,25.35 24.75,25.35 | 24.75,25.35 35.4,25.35 38.1,22.65 38.4,22.65 39.43,21.62 | 39.43,21.62 v39.75,21.3 | v80.1,25.57 80.47,25.57 80.55,25.52 | 80.55,25.52 81.15,25.05 R78.1 | 15.6,19.2 15.4,18.86 v15.6,18.75 | 15.6,19.2 15.79,18.86 v15.6,18.75 | 16.65,24.75 16.84,25.09 v16.65,25.2 | 16.65,24.75 16.45,25.09 v16.65,25.2 | 24.75,25.35 24.41,25.55 v24.3,25.35 | 24.75,25.35 24.41,25.16 v24.3,25.35 | 39.43,21.62 39.53,21.24 v39.75,21.3 | 39.43,21.62 39.81,21.52 v39.75,21.3 | 80.55,25.52 80.24,25.75 v80.1,25.57 | 80.55,25.52 80.19,25.37 v80.1,25.57
  Bottom 0.15: 40.09,21.6 39.9,21.6 39.6,21.3 v39.75,21.3 | 40.09,21.6 69.6,21.6 70.95,22.95 73.2,22.95 73.65,23.4 73.65,24 75.45,25.8 79.71,25.8 | 15.71,18.31 15.75,18.15 IC3.22 | 15.71,18.31 v15.6,18.75 | v16.65,25.2 17.1,25.2 | 17.1,25.2 17.55,25.2 17.7,25.35 23.85,25.35 | 23.85,25.35 v24.3,25.35 | 79.95,25.8 v80.1,25.57 | 79.71,25.8 79.95,25.8 | 15.71,18.31 15.82,18.69 v15.6,18.75 | 15.71,18.31 15.44,18.59 v15.6,18.75 | 17.1,25.2 16.76,25.39 v16.65,25.2 | 17.1,25.2 16.76,25 v16.65,25.2 | 23.85,25.35 24.19,25.16 v24.3,25.35 | 23.85,25.35 24.19,25.55 v24.3,25.35 | 40.09,21.6 39.7,21.52 v39.75,21.3 | 40.09,21.6 39.96,21.23 v39.75,21.3 | 79.71,25.8 79.91,25.46 v80.1,25.57 | 79.95,25.8 80.1,25.8 v80.1,25.57
GND  (via drill 0.3)
  Top 0.3: 59.25,17.55 55.35,17.55 54.6,16.8 IC2.11 54.6,14.85 53.72,13.97 | 59.25,17.55 59.7,17.55 | 66.53,7.2 69.45,7.2 Q7.E 70.65,6.15 71.25,6.15 72.3,7.2 74.78,7.2 | Q2.E 66.45,6.15 66.45,7.12 66.53,7.2 | 74.78,7.2 74.78,6.15 Q8.E | 78.9,7.2 Q9.E | 74.78,7.2 78.9,7.2 | Q10.E 83.17,7.12 83.1,7.2 | 78.9,7.2 83.1,7.2 | 83.1,7.2 86.25,7.2 Q11.E | 59.85,16.95 60,16.23 | 60,16.23 59.85,16.05 61.5,14.4 61.5,10.65 | 59.85,16.95 59.85,17.07 | 59.85,17.07 59.85,17.55 | v40.5,13.65 40.82,13.97 | 40.82,13.97 42,15.15 IC1.11 | C23.1 24,15.3 22.65,16.65 22.65,19.65 C25.1 22.65,19.8 22.95,20.1 22.95,21 | 25.88,13.28 24,15.15 C23.1 | 25.88,13.28 25.95,13.2 25.95,12.15 TP4.TP | 22.95,21 22.95,23.03 | 22.95,23.03 22.95,24.3 AUX2.4 | 22.95,21 23.4,21 | 23.4,21 v23.85,21 | v6.6,28.35 6.92,28.03 | 6.92,28.03 7.8,27.15 D7.C | v21.15,9.45 21.15,9 | 21.15,9 21.15,8.4 C26.1 | v25.2,15.6 24.88,15.28 | 24.88,15.28 24.45,14.85 C23.1 | v53.4,13.65 53.72,13.97 | 32.55,15 28.05,15 26.78,13.73 | 32.55,15 v33,15 | 26.78,13.73 26.4,13.35 26.1,13.35 | 26.1,13.35 25.95,13.35 25.88,13.28 | 8.7,33.45 8.7,35.1 C19.- | 8.7,33.45 C20.- | v7.95,33.45 8.4,33.45 | 8.4,33.45 8.7,33.45 | 59.25,17.55 R101.1 | 59.25,17.55 59.77,17.03 | 59.77,17.03 59.85,16.95 | 62.1,7.2 66.53,7.2 | 7.05,9.6 8.1,9.6 OK1.4 8.1,9.75 8.1,11.1 8.85,11.85 9.75,11.85 10.8,10.8 10.8,6.45 | 7.05,9.6 v6.6,9.6 | v10.8,6 10.8,6.45 | 40.82,13.97 40.44,13.79 v40.5,13.65 | 40.82,13.97 40.63,13.59 v40.5,13.65 | 23.4,21 23.8,20.86 v23.85,21 | 23.4,21 23.8,21.14 v23.85,21 | 6.92,28.03 6.74,28.41 v6.6,28.35 | 6.92,28.03 6.54,28.21 v6.6,28.35 | 21.15,9 21.29,9.4 v21.15,9.45 | 21.15,9 21.01,9.4 v21.15,9.45 | 24.88,15.28 25.27,15.46 v25.2,15.6
  Top 0.3: 24.88,15.28 25.07,15.66 v25.2,15.6 | 53.72,13.97 53.34,13.79 v53.4,13.65 | 53.72,13.97 53.53,13.59 v53.4,13.65 | 32.55,15 32.95,14.86 v33,15 | 32.55,15 32.95,15.14 v33,15 | 8.4,33.45 8,33.59 v7.95,33.45 | 8.4,33.45 8,33.31 v7.95,33.45 | 26.78,13.73 26.45,13.47 v26.55,13.35 | 26.78,13.73 26.7,13.32 v26.55,13.35 | 26.1,13.35 26.5,13.21 v26.55,13.35 | 26.1,13.35 26.5,13.49 v26.55,13.35 | 60,16.23 60.12,16.56 v60,16.65 | 60,16.23 v60,16.65 | v60,16.65 | 59.85,17.07 59.85,16.65 v60,16.65 | 59.85,17.07 60.12,16.74 v60,16.65 | 59.77,17.03 59.85,16.62 v60,16.65 | 59.77,17.03 60.09,16.77 v60,16.65 | 7.05,9.6 6.65,9.74 v6.6,9.6 | 7.05,9.6 6.65,9.46 v6.6,9.6 | 10.8,6.45 10.66,6.05 v10.8,6 | 10.8,6.45 10.94,6.05 v10.8,6 | 22.95,23.03 23.5,24.03 AUX2.4 | 22.95,23.03 22.5,24.08 AUX2.4
  Bottom 0.3: 56.25,14.25 56.25,14.7 R52.1 56.25,14.25 | 56.25,14.25 56.25,12.3 R61.1 | 53.1,13.65 53.1,13.99 | 53.1,13.99 53.1,14.55 R34.1 53.1,14.7 53.4,14.4 54.6,14.4 C14.1 54.6,14.25 56.25,14.25 | 53.1,13.5 53.1,13.65 | 53.1,13.5 53.1,13.31 | 53.1,13.31 53.1,12.3 R63.1 | 43.65,14.25 43.65,14.7 R2B.1 43.65,14.25 | 43.65,14.25 43.65,13.5 | 43.65,13.5 43.65,12.3 R68.2 | R65.1 40.5,14.7 40.8,14.4 42,14.4 C16.1 42,14.25 43.65,14.25 | 40.5,14.1 40.5,14.55 R65.1 | 40.5,14.1 v40.5,13.65 | v40.5,13.65 40.5,13.2 | 40.5,13.2 40.5,12.3 R69.2 | 43.65,13.5 52.98,13.5 | 52.98,13.5 53.1,13.5 | 31.8,15.6 C22.1 31.8,15.3 | 31.8,15.6 C21.1 31.8,16.8 | 23.85,20.55 23.85,19.8 IC3.30 | 23.85,20.55 24.07,20.77 v23.85,21 | 33.15,15.6 31.8,15.6 | 33.15,15.6 39.45,15.6 40.35,14.7 R65.1 | 7.35,28.35 7.35,29.25 7.95,29.85 U$1.LEFT 7.95,30 7.95,33 | 7.35,28.35 7.35,27.45 C18.1 7.35,27.3 7.35,25.35 10.5,22.2 10.5,19.05 12.45,17.1 13.8,17.1 | 7.35,28.35 7.05,28.35 | 7.05,28.35 v6.6,28.35 | v21.15,9.45 20.83,9.13 | 20.83,9.13 20.7,9 20.7,8.25 IC3.8 | 20.92,11.03 21,10.95 21,10.23 | 20.92,11.03 20.77,11.18 | 20.77,11.18 17.25,14.7 16.5,14.7 IC3.18 | 21,10.2 21,9.87 | 21,9.87 21,9.45 | 21,10.2 21,10.23 | 21,9.45 v21.15,9.45 | 25.2,14.7 24.3,14.7 20.77,11.18 | 25.2,14.7 27.9,14.7 IC3.38 | 14.1,2.7 12.3,2.7 C36.1 12.3,2.85 9.75,5.4 9.75,6 9.68,6.08 | 14.1,2.7 15.9,2.7 | 14.1,2.7 C37.1 | 17.7,2.7 19.5,2.7 | 21.3,2.7 23.1,2.7 | 23.1,2.7 24.9,2.7 | 23.1,2.7 C9.1 | 24.9,2.7 26.7,2.7 | 24.9,2.7 C29.1 | 26.7,2.7 27.6,2.7 | 27.6,2.7 28.5,2.7 | 26.7,2.7 C6.1 | 28.5,2.7 30.3,2.7 | 28.5,2.7 C5.1 | 30.3,2.7 32.1,2.7 | 30.3,2.7 C4.1 | 32.1,2.7 33.9,2.7 | 32.1,2.7 C3.1 | 33.9,2.7 35.7,2.7 | 33.9,2.7 C2.1
  Bottom 0.3: 35.7,2.7 37.5,2.7 C13.1 | 35.7,2.7 C1.1 | 19.5,2.7 21.3,2.7 | 19.5,2.7 C28.1 | 21.3,2.7 R31.2 | 15.9,2.7 17.7,2.7 | 15.9,2.7 C27.1 | 17.7,2.7 R29.2 | 21,10.2 25.65,10.2 27.07,8.78 | 27.07,8.78 27.6,8.25 27.6,8.06 | 27.6,2.7 27.6,8.06 | 4.65,9.75 C24.1 4.8,9.6 6.15,9.6 | 25.2,14.7 25.2,15.15 | 25.2,15.15 v25.2,15.6 | v53.4,13.65 53.1,13.65 | 33.15,15.42 33.15,15.6 | 7.95,33 v7.95,33.45 | v7.95,33.45 7.95,33.9 | 7.95,33.9 7.95,37.35 6.9,38.4 6.9,40.2 C17.1 | v6.6,9.6 6.15,9.6 | 9.68,6.08 9.6,6.15 6.15,6.15 5.7,6 R77.2 | 10.65,6.15 v10.8,6 | 10.38,6.15 9.75,6.15 9.68,6.08 | 10.38,6.15 10.65,6.15 | AUX1.4 33.75,24.3 33.75,23.03 | 33.75,23.03 33.75,21.15 33.75,21.06 | 40.5,14.1 40.36,13.7 v40.5,13.65 | 40.5,14.1 40.64,13.7 v40.5,13.65 | 40.5,13.2 40.64,13.6 v40.5,13.65 | 40.5,13.2 40.36,13.6 v40.5,13.65 | 23.85,20.55 23.99,20.95 v23.85,21 | 23.85,20.55 23.71,20.95 v23.85,21 | 7.05,28.35 6.65,28.49 v6.6,28.35 | 7.05,28.35 6.65,28.21 v6.6,28.35 | 20.83,9.13 21.21,9.31 v21.15,9.45 | 20.83,9.13 21.02,9.52 v21.15,9.45 | 21,9.87 21,9.45 | 21,9.45 v21.15,9.45 | 21,9.87 21.27,9.54 v21.15,9.45 | 25.2,15.15 25.34,15.55 v25.2,15.6 | 25.2,15.15 25.06,15.55 v25.2,15.6 | 53.1,13.99 53.26,13.59 v53.4,13.65 | 53.1,13.99 53.47,13.78 v53.4,13.65 | 53.1,13.31 53.47,13.52 v53.4,13.65 | 53.1,13.31 53.26,13.71 v53.4,13.65 | 52.98,13.5 53.4,13.5 v53.4,13.65 | 52.98,13.5 53.31,13.77 v53.4,13.65 | 33.15,15.42 32.88,15.09 v33,15 33.15,15 33.15,15.42 | 7.95,33 8.09,33.4 v7.95,33.45 | 7.95,33 7.81,33.4 v7.95,33.45 | 7.95,33.9 7.81,33.5 v7.95,33.45 | 7.95,33.9 8.09,33.5 v7.95,33.45 | 27.07,8.78 27.15,8.37 v27.3,8.4 | 27.07,8.78 27.39,8.52 v27.3,8.4 | 27.6,8.06 27.44,8.46 v27.3,8.4
  Bottom 0.3: 27.6,8.06 27.23,8.27 v27.3,8.4 | 20.92,11.03 21,10.62 v21.15,10.65 | 20.92,11.03 21.25,10.77 v21.15,10.65 | 21,10.23 21.27,10.56 v21.15,10.65 | 21,10.23 21,10.65 v21.15,10.65 | 6.15,9.6 6.55,9.46 v6.6,9.6 | 6.15,9.6 6.55,9.74 v6.6,9.6 | 10.38,6.15 10.71,5.88 v10.8,6 | 10.65,6.15 10.8,6.15 v10.8,6 | 33.75,23.03 34.3,24.03 AUX1.4 | 33.75,23.03 33.3,24.08 AUX1.4
  other vias: 33.75,20.4 23.25,5.85 27.6,5.7 22.65,13.8 24.75,16.2 27,20.55 20.1,13.8 31.65,9.3 18.15,13.35 18.15,10.95 41.4,20.55 49.5,20.7 57.45,20.7 57.9,20.1 61.95,15 61.95,9.75 61.95,7.95 55.35,3.9 57,3.9 52.8,6.45 54.6,6.45 59.85,7.95 60.6,9.15 61.2,11.1 61.35,12.9 47.4,16.95 49.2,16.95 48.3,16.95 40.05,19.2 39,20.55 34.65,15.9 35.4,8.7 36.75,11.55 37.65,8.7 48,11.7 46.65,11.1 46.35,8.55 49.8,11.55 54.45,7.95 38.7,3.9 20.85,16.35 22.65,18.15 73.2,20.7 62.25,20.7 77.25,23.7 75.3,19.95 75.75,23.25 49.35,8.55 48.3,6.75 46.8,6.75 79.5,23.55 79.5,21
  pour Bottom: 13.8,21 62.1,21.15 73.2,21.15 75.45,23.25 75.45,25.65 79.8,25.65 79.8,19.05 62.1,19.05 62.1,2.25 13.8,2.1
  pour Top: 13.8,21 54.9,21 56.1,22.2 61.35,22.2 61.35,21.15 73.2,21.15 75.45,23.25 75.45,25.65 79.8,25.65 79.8,19.5 67.8,19.5 67.8,17.85 62.1,17.85 62.1,2.1 13.8,2.1
I_ACT_HI  (via drill 0.3)
  Top 0.15: v24.6,6 24.92,6.32 | 24.92,6.32 25.2,6.6 25.95,6.6 26.25,6.3 26.55,6.3 27.3,7.05 33,7.05 33.6,6.45 34.2,6.45 35.1,7.35 37.65,7.35 38.7,8.4 R92.1 | 24.92,6.32 24.54,6.22 v24.6,6 | 24.92,6.32 24.82,5.94 v24.6,6
  Bottom 0.15: 24.9,6.33 24.9,6.3 v24.6,6 | 24.9,6.33 24.9,7.95 24.75,8.1 IC3.3 | 24.28,5.68 23.1,4.5 C9.2 | 24.28,5.68 v24.6,6 | 24.9,6.33 24.53,6.21 v24.6,6 | 24.9,6.33 24.82,5.95 v24.6,6 | 24.28,5.68 24.66,5.78 v24.6,6 | 24.28,5.68 24.38,6.06 v24.6,6
I_ACT_LOW  (via drill 0.3)
  Top 0.15: v25.8,5.85 25.95,5.85 26.1,6 26.22,6 | 26.22,6 26.7,6 27.45,6.75 32.85,6.75 33.45,6.15 34.35,6.15 35.25,7.05 40.95,7.05 41.1,6.9 42,6.9 43.5,8.4 R91.1 | 26.22,6 25.77,6 v25.8,5.85 | 26.22,6 25.97,5.7 v25.8,5.85
  Bottom 0.15: C29.2 24.9,5.1 25.35,5.85 | 25.35,5.85 25.35,8.1 IC3.2 | 25.35,5.85 v25.8,5.85 | 25.35,5.85 25.69,5.66 v25.8,5.85 | 25.35,5.85 25.69,6.04 v25.8,5.85
I_RAW_HI_R  (via drill 0.3)
  Top 0.15: v41.25,7.5 41.25,7.95 | 41.25,7.95 41.25,9 40.8,9.45 40.8,10.8 IC1.3 40.8,10.95 40.8,11.55 41.55,12.3 42.15,12.3 43.8,13.95 45,13.95 45.15,14.1 45.15,17.25 45.45,17.55 46.2,17.55 47.68,19.03 | 47.68,19.03 v48,19.35 | v76.35,24 76.5,24.15 76.5,24.42 | 76.5,24.42 76.5,24.75 76.65,24.9 R95.1 | 41.25,7.95 41.05,7.46 v41.25,7.5 | 41.25,7.95 41.45,7.61 v41.25,7.5 | 47.68,19.03 48.06,19.13 v48,19.35 | 47.68,19.03 47.78,19.41 v48,19.35 | 76.5,24.42 76.2,24.17 v76.35,24 | 76.5,24.42 76.57,24.04 v76.35,24
  Bottom 0.15: 36.6,6.75 37.35,6 37.35,4.65 37.5,4.5 C13.2 | v41.25,7.5 41.25,7.65 41.1,7.8 40.91,7.8 | 40.91,7.8 37.65,7.8 36.6,6.75 | 36.6,6.75 R97.2 | 48.34,19.05 48.3,19.05 v48,19.35 | 48.34,19.05 51.15,19.05 51.75,19.65 52.65,19.65 52.95,19.95 55.05,19.95 55.5,19.5 61.8,19.5 62.55,18.75 66.45,18.75 67.5,19.8 68.85,19.8 69,19.65 73.05,19.65 74.1,20.7 74.7,20.7 76.35,22.35 76.35,23.55 | 76.35,23.55 v76.35,24 | 40.91,7.8 41.04,7.43 v41.25,7.5 | 40.91,7.8 41.3,7.72 v41.25,7.5 | 48.34,19.05 48.21,19.42 v48,19.35 | 48.34,19.05 47.95,19.13 v48,19.35 | 76.35,23.55 76.55,23.89 v76.35,24 | 76.35,23.55 76.16,23.89 v76.35,24
I_RAW_LOW  (via drill 0.3)
  Top 0.15: 39.58,17.98 38.85,17.25 38.85,14.1 | 39.58,17.98 v39.9,18.3 | v38.85,13.65 38.85,14.1 | v42.75,9.3 42.75,9.6 42.88,9.73 | 42.88,9.73 43.2,10.05 IC1.5 | v78.75,24 78.75,24.45 | 78.75,24.45 R502.2 | 39.58,17.98 39.96,18.08 v39.9,18.3 | 39.58,17.98 39.68,18.36 v39.9,18.3 | 38.85,14.1 38.66,13.76 v38.85,13.65 | 38.85,14.1 39.05,13.76 v38.85,13.65 | 42.88,9.73 42.6,9.46 v42.75,9.3 | 42.88,9.73 42.97,9.35 v42.75,9.3 | 78.75,24.45 78.56,24.11 v78.75,24 | 78.75,24.45 78.94,24.11 v78.75,24
  Bottom 0.15: v39.9,18.3 40.35,18.3 | 40.35,18.3 42.45,18.3 43.35,19.2 44.55,19.2 44.85,18.9 45.75,19.8 46.35,19.8 46.95,19.2 46.95,18.9 47.1,18.75 51.3,18.75 51.9,19.35 52.8,19.35 53.1,19.65 54.9,19.65 55.35,19.2 61.65,19.2 62.4,18.45 66.6,18.45 67.65,19.5 68.7,19.5 68.85,19.35 73.2,19.35 74.25,20.4 74.85,20.4 78.32,23.87 | 39.17,13.33 39.6,12.9 39.6,11.7 39.9,11.4 41.4,11.4 41.55,11.25 41.55,9.75 41.4,9.6 41.4,8.85 41.55,8.7 42.15,8.7 42.43,8.98 | 39.17,13.33 v38.85,13.65 | v42.75,9.3 42.43,8.98 | v78.75,24 78.45,24 78.32,23.87 | 40.35,18.3 40.01,18.5 v39.9,18.3 | 40.35,18.3 40.01,18.11 v39.9,18.3 | 39.17,13.33 39.07,13.71 v38.85,13.65 | 39.17,13.33 38.79,13.43 v38.85,13.65 | 42.43,8.98 42.81,9.08 v42.75,9.3 | 42.43,8.98 42.68,9.51 v42.75,9.3 | 78.32,23.87 78.7,23.78 v78.75,24 | 78.32,23.87 78.59,24.15 v78.75,24
LED1  (via drill 0.3)
  Top 0.15: v11.25,2.25 11.25,2.7 | 11.25,2.7 11.25,3.3 11.55,3.9 11.55,18.33 | 11.55,18.33 11.55,18.6 v11.7,18.75 | v15.15,18 15.6,18 | 15.6,18 15.75,18 17.12,19.37 | 17.12,19.37 17.25,19.5 v17.25,19.8 | 11.25,2.7 11.05,2.36 v11.25,2.25 | 11.25,2.7 11.45,2.36 v11.25,2.25 | 11.55,18.33 11.85,18.58 v11.7,18.75 | 11.55,18.33 11.48,18.71 v11.7,18.75 | 15.6,18 15.26,18.2 v15.15,18 | 15.6,18 15.26,17.8 v15.15,18 | 17.12,19.37 17.4,19.64 v17.25,19.8 | 17.12,19.37 17.03,19.75 v17.25,19.8
  Bottom 0.15: 11.59,1.95 11.55,1.95 v11.25,2.25 | 11.59,1.95 78.9,1.95 80.1,3.15 98.55,3.15 99,3.75 99.45,4.2 99.45,23.7 97.95,25.2 R12.1 | v11.7,18.75 11.55,18.6 12.13,18.62 | 12.13,18.62 12.15,18.6 14.55,18.15 14.68,18.13 | 14.68,18.13 v15.15,18 | v17.25,19.8 17.7,19.8 | 17.7,19.8 18.15,19.8 IC3.23 | 11.59,1.95 11.46,2.32 v11.25,2.25 | 11.59,1.95 11.2,2.03 v11.25,2.25 | 12.13,18.62 11.77,19 v11.7,18.75 | 12.13,18.62 11.55,18.59 v11.7,18.75 | 14.68,18.13 15.21,17.78 v15.15,18 | 14.68,18.13 15.08,18.21 v15.15,18 | 17.7,19.8 17.36,20 v17.25,19.8 | 17.7,19.8 17.36,19.61 v17.25,19.8
MISO
  Bottom 0.15: IC3.26 20.55,19.8 20.55,21.75 18.86,23.44 18,24.3 AUX2.2
  Bottom 0.3: 18.86,23.44 18.45,24.5 AUX2.2 17.77,24.07 18.86,23.44
MOSI
  Bottom 0.15: IC3.25 19.8,19.8 19.8,21.75 18.3,23.25 16.5,23.25 15.45,24.3 AUX2.1
N$1  (via drill 0.3)
  Top 0.15: v43.95,17.7 43.95,17.25 | 43.95,17.25 43.95,16.8 43.35,16.2 IC1.10 | 45.58,18.58 45.45,18.45 44.7,18.45 44.27,18.02 | 45.58,18.58 v46.05,18.9 | v43.95,17.7 44.27,18.02 | v68.55,18.9 69,18.9 | 69,18.9 72.75,18.9 73.65,19.8 73.95,19.8 74.4,19.35 74.4,19.05 77.85,15.6 81.9,15.6 82.65,14.85 84.15,14.85 | 84.15,14.85 v84.6,14.85 | 43.95,17.25 43.84,17.59 v43.95,17.7 | 43.95,17.25 43.76,17.59 v43.95,17.7 | 44.27,18.02 43.89,17.92 v43.95,17.7 | 44.27,18.02 44.02,17.64 v43.95,17.7 | 45.58,18.58 46.26,18.83 v46.05,18.9 | 45.58,18.58 45.83,18.96 v46.05,18.9 | 69,18.9 68.66,19.09 v68.55,18.9 | 69,18.9 68.66,18.7 v68.55,18.9 | 84.15,14.85 84.49,14.65 v84.6,14.85 | 84.15,14.85 84.49,15.04 v84.6,14.85
  Bottom 0.15: 44.18,17.32 44.4,17.1 44.4,15.6 45.15,14.85 R2B.2 | 44.18,17.32 43.95,17.55 v43.95,17.7 | v46.05,18.9 46.37,18.58 | 46.37,18.58 46.8,18.15 51.6,18.15 52.2,18.75 53.1,18.75 53.4,19.05 54.6,19.05 55.05,18.6 61.35,18.6 62.1,17.85 67.5,17.85 68.23,18.58 | 68.23,18.58 v68.55,18.9 | v84.6,14.85 84.75,14.85 84.98,14.62 | 84.98,14.62 85.5,14.1 R1B.2 | 44.18,17.32 44.02,17.7 v43.95,17.7 | 44.18,17.32 43.84,17.5 v43.95,17.7 | 46.37,18.58 46.27,18.96 v46.05,18.9 | 46.37,18.58 45.99,18.83 v46.05,18.9 | 68.23,18.58 68.76,18.83 v68.55,18.9 | 68.23,18.58 68.48,19.11 v68.55,18.9 | 84.98,14.62 84.8,14.96 v84.6,14.85 | 84.98,14.62 84.59,14.62 v84.6,14.85
N$2  (via drill 0.3)
  Top 0.15: v39.6,13.8 39.6,14.25 | 39.6,14.25 39.6,14.4 40.65,15.45 40.65,16.05 IC1.12 40.8,16.2 40.8,16.65 41.38,17.38 | 41.38,17.38 v41.85,17.7 | v67.8,18.9 68.12,19.37 | 68.12,19.37 68.4,19.5 68.85,19.5 69.15,19.2 72.6,19.2 73.5,20.1 74.1,20.1 74.7,19.5 74.7,19.2 78,15.9 80.06,15.9 | 80.06,15.9 80.1,15.9 v80.4,16.2 | 39.6,14.25 39.41,13.91 v39.6,13.8 | 39.6,14.25 39.8,13.91 v39.6,13.8 | 41.38,17.38 41.91,17.48 v41.85,17.7 | 41.38,17.38 41.63,17.76 v41.85,17.7 | 68.12,19.37 67.74,19.12 v67.8,18.9 | 68.12,19.37 67.87,18.69 v67.8,18.9 | 80.06,15.9 80.45,15.98 v80.4,16.2 | 80.06,15.9 80.19,16.27 v80.4,16.2
  Bottom 0.15: 39.37,14.18 38.85,14.7 R65.2 | 39.37,14.18 39.6,13.95 v39.6,13.8 | 42.3,17.7 43.5,18.9 44.4,18.9 44.7,18.6 45,18.6 45.9,19.5 46.2,19.5 46.65,19.05 46.65,18.75 46.95,18.45 51.45,18.45 52.05,19.05 52.95,19.05 53.25,19.35 54.75,19.35 55.2,18.9 61.5,18.9 62.25,18.15 67.2,18.15 67.52,18.47 | v41.85,17.7 42.3,17.7 | 67.52,18.47 67.8,18.6 v67.8,18.9 | v80.4,16.2 80.85,16.2 | 80.85,16.2 81,16.2 81.3,15.9 R58.2 | 39.37,14.18 39.38,13.79 v39.6,13.8 | 39.37,14.18 39.71,14 v39.6,13.8 | 42.3,17.7 41.96,17.89 v41.85,17.7 | 42.3,17.7 41.96,17.5 v41.85,17.7 | 67.52,18.47 67.95,18.74 v67.8,18.9 | 67.52,18.47 67.58,18.85 v67.8,18.9 | 80.85,16.2 80.51,16.39 v80.4,16.2 | 80.85,16.2 80.51,16 v80.4,16.2
N$3  (via drill 0.3)
  Top 0.15: v44.7,17.7 44.38,17.38 | 44.38,17.38 44.25,17.25 44.25,16.35 44.4,16.2 IC1.9 | 45.6,18 45.15,18 45.02,18.02 | 45.6,18 v46.05,18.15 | v44.7,17.7 45.02,18.02 | v68.55,18.15 68.7,18 68.98,18.28 | 68.98,18.28 69.3,18.6 73.95,18.6 77.4,15.15 77.4,14.85 77.85,14.4 79.2,14.4 79.48,14.61 | 79.48,14.61 v79.95,14.85 | 44.38,17.38 44.76,17.48 v44.7,17.7 | 44.38,17.38 44.63,17.76 v44.7,17.7 | 45.02,18.02 44.64,17.92 v44.7,17.7 | 45.02,18.02 44.92,17.64 v44.7,17.7 | 45.6,18 45.94,17.95 v46.05,18.15 | 45.6,18 45.94,18.34 v46.05,18.15 | 68.98,18.28 68.6,18.37 v68.55,18.15 | 68.98,18.28 68.71,18 v68.55,18.15 | 79.48,14.61 80.01,14.63 v79.95,14.85 | 79.48,14.61 79.73,14.91 v79.95,14.85
  Bottom 0.15: 44.38,18.02 44.1,18.3 43.8,18.3 43.35,17.85 43.35,16.65 43.5,16.5 R66.2 | 44.38,18.02 44.55,17.85 44.55,17.7 v44.7,17.7 | v46.05,18.15 46.35,17.85 46.39,17.85 | 46.39,17.85 51.75,17.85 52.35,18.45 53.25,18.45 53.55,18.75 54.45,18.75 54.9,18.3 61.2,18.3 61.95,17.55 68.25,17.55 68.42,17.72 | 68.42,17.72 68.55,17.85 v68.55,18.15 | v79.95,14.85 80.4,14.85 | 80.4,14.85 80.55,14.85 81.3,14.1 R59.2 | 44.38,18.02 44.63,17.64 v44.7,17.7 | 44.38,18.02 44.76,17.92 v44.7,17.7 | 46.39,17.85 46.26,18.22 v46.05,18.15 | 46.39,17.85 46,17.93 v46.05,18.15 | 68.42,17.72 68.7,17.99 v68.55,18.15 | 68.42,17.72 68.33,18.1 v68.55,18.15 | 80.4,14.85 80.06,15.04 v79.95,14.85 | 80.4,14.85 80.06,14.65 v79.95,14.85
N$4  (via drill 0.3)
  Top 0.5: v39.45,32.4 38.25,33.6 33,33.6 32.85,33.45 R8.1
  Bottom 0.3: T2.1 40.65,31.2
  Bottom 0.5: v39.45,32.4 39.9,32.4 40.65,31.65 40.65,31.35 T2.1
N$5
  Top 0.3: U$4.3 66.6,38.85 R87.2
N$6  (via drill 0.3)
  Top 0.3: v67.8,11.55 68.12,11.87 | 68.12,11.87 68.55,12.3 68.55,13.5 T8.P$6 | 68.12,11.87 67.73,11.54 v67.8,11.55 | 68.12,11.87 67.94,11.48 v67.8,11.55
  Bottom 0.3: v67.8,11.55 67.8,11.25 67.67,11.12 | 67.67,11.12 67.35,10.8 67.35,6.45 66.75,4.5 R22.2 | 67.67,11.12 67.92,11.46 v67.8,11.55 | 67.67,11.12 67.65,11.54 v67.8,11.55
N$7  (via drill 0.3)
  Top 0.15: v73.8,19.2 74.12,18.88 | 74.12,18.88 77.68,15.32 | 77.68,15.32 v78,15 | v40.05,17.55 40.05,17.1 | 40.05,17.1 40.05,16.65 39.6,16.2 IC1.13 | 74.12,18.88 74.02,19.26 v73.8,19.2 | 74.12,18.88 73.74,18.98 v73.8,19.2 | 77.68,15.32 77.78,14.94 v78,15 | 77.68,15.32 78.06,15.22 v78,15 | 40.05,17.1 40.24,17.44 v40.05,17.55 | 40.05,17.1 39.85,17.44 v40.05,17.55